# EAGLE schematic RadioMusic_B Rev2 (EAGLE 6.6.0)
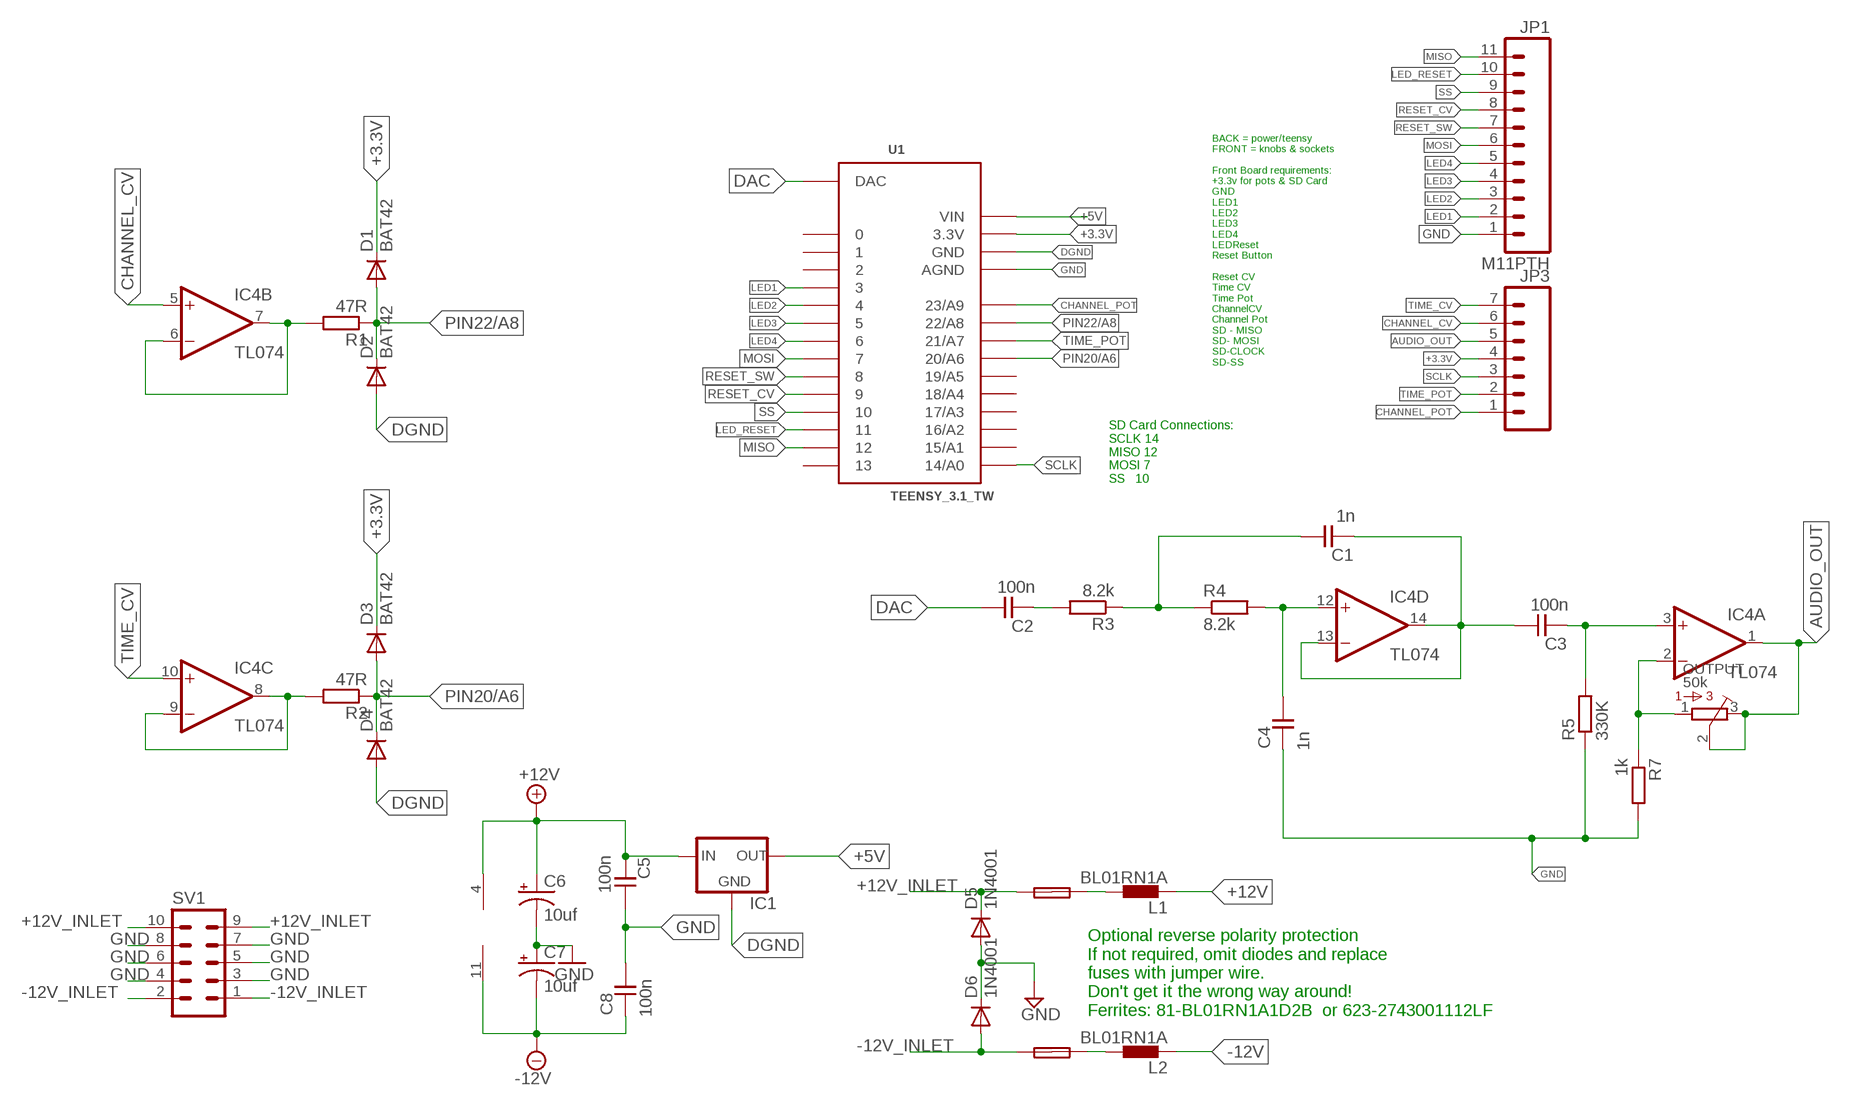
[diagram p0: schematic, sheet 1]

## Parts
C1  1n  C-EU050-024X044  [C050-024X044]
C2  100n  C-EU050-025X075  [C050-025X075]
C3  100n  C-EU050-025X075  [C050-025X075]
C4  1n  C-EU050-024X044  [C050-024X044]
C5  100n  C-EU050-024X044  [C050-024X044]
C6  10uf  CAP_POLPTH2  [CPOL-RADIAL-10UF-25V]
C7  10uf  CAP_POLPTH2  [CPOL-RADIAL-10UF-25V]
C8  100n  C-EU050-024X044  [C050-024X044]
D1  BAT42  BAT81  [DO34-7]
D2  BAT42  BAT81  [DO34-7]
D3  BAT42  BAT81  [DO34-7]
D4  BAT42  BAT81  [DO34-7]
D5  1N4001  1N4004  [DO41-10]
D6  1N4001  1N4004  [DO41-10]
F1  FUSE  PTC_FUSEPOLY_FUSE  [C050H075X075]
F2  FUSE  PTC_FUSEPOLY_FUSE  [C050H075X075]
IC1  78LXX  [78LXX]
IC4  TL074  TL074P  [DIL14]
JP1  M11PTH  [1X11]
JP3  M07  [1X07]
L1  BL01RN1A  [BL01RN1A]
L2  BL01RN1A  [BL01RN1A]
OUTPUT  50k  3362P  [3362P]
R1  47R  R-EU_STANDARD_RESISTOR  [0207/10]
R2  47R  R-EU_STANDARD_RESISTOR  [0207/10]
R3  8.2k  R-EU_STANDARD_RESISTOR  [0207/10]
R4  8.2k  R-EU_STANDARD_RESISTOR  [0207/10]
R5  330K  R-EU_STANDARD_RESISTOR  [0207/10]
R7  1k  R-EU_STANDARD_RESISTOR  [0207/10]
SV1  10_PIN_HEADER  [MA05-2]
U1  TEENSY_3.1_TW  [TEENSY_3.1_TW]

## Nets
+3.3V: D1.C D3.C JP3.4 U1.3.3V
+5V: IC1.OUT U1.VIN
+12V [power]: C5.2 C6.1(+) IC1.IN IC4.4(P:V+) L1.1
+12V_INLET [power]: D5.C F1.1 SV1.9 SV1.10
-12V [power]: C7.2(-) C8.2 IC4.11(P:V-) L2.1
-12V_INLET [power]: D6.A F2.1 SV1.1 SV1.2
AUDIO_OUT: IC4.1(A:OUT) JP3.5 OUTPUT.2 OUTPUT.3
CHANNEL_CV: IC4.5(B:+IN) JP3.6
CHANNEL_POT: JP3.1 U1.23/A9
DAC: C2.1 U1.DAC
DGND: D2.A D4.A IC1.GND U1.GND
GND [ground]: C4.2 C5.1 C6.2(-) C7.1(+) C8.1 D5.A D6.C JP1.1 R5.1 R7.2 SV1.3 SV1.4 SV1.5 SV1.6 SV1.7 SV1.8 U1.AGND
LED1: JP1.2 U1.3
LED2: JP1.3 U1.4
LED3: JP1.4 U1.5
LED4: JP1.5 U1.6
LED_RESET: JP1.10 U1.11
MISO: JP1.11 U1.12
MOSI: JP1.6 U1.7
N$1: IC4.8(C:OUT) IC4.9(C:-IN) R2.2
N$2: C4.1 IC4.12(D:+IN) R4.2
N$3: IC4.6(B:-IN) IC4.7(B:OUT) R1.2
N$4: C1.1 R3.1 R4.1
N$5: C1.2 C3.1 IC4.13(D:-IN) IC4.14(D:OUT)
N$6: C3.2 IC4.3(A:+IN) R5.2
N$7: IC4.2(A:-IN) OUTPUT.1 R7.1
N$10: C2.2 R3.2
N$22 [power]: F1.2 L1.2
N$23 [power]: F2.2 L2.2
PIN20/A6: D3.A D4.C R2.1 U1.20/A6
PIN22/A8: D1.A D2.C R1.1 U1.22/A8
RESET_CV: JP1.8 U1.9
RESET_SW: JP1.7 U1.8
SCLK: JP3.3 U1.14/A0
SS: JP1.9 U1.10
TIME_CV: IC4.10(C:+IN) JP3.7
TIME_POT: JP3.2 U1.21/A7
Unconnected: U1.0 U1.1 U1.2 U1.13 U1.15/A1 U1.16/A2 U1.17/A3 U1.18/A4 U1.19/A5

## Notes on the sheet
- BACK = power/teensy
  FRONT = knobs & sockets
  
  Front Board requirements:
  +3.3v for pots & SD Card 
  GND 
  LED1
  LED2
  LED3
  LED4
  LEDReset
  Reset Button
  
  Reset CV 
  Time CV
  Time Pot
  ChannelCV
  Channel Pot
  SD - MISO
  SD- MOSI
  SD-CLOCK
  SD-SS
- SD Card Connections: 
   SCLK 14
   MISO 12
   MOSI 7 
   SS   10
- Optional reverse polarity protection
  If not required, omit diodes and replace
  fuses with jumper wire. 
  Don't get it the wrong way around! 
  Ferrites: 81-BL01RN1A1D2B  or 623-2743001112LF

## Library data of the parts
C1-C5 C8 = TomW:C-EU: CAPACITOR, European symbol
C6 C7 = SparkFun-Passives:CAP_POL: Capacitor Polarized These are standard SMD and PTH capacitors. Normally 10uF, 47uF, and 100uF in electrolytic and tantalum varieties. Always verify the external diameter of the through hole cap, it varies with capacity, voltage, and manufacturer. The EIA devices should be standard.
D1-D4 = diode:BAT81: DIODE barrier diode
D5 D6 = diode:1N4004: DIODE general purpose rectifier, 1 A
F1 F2 = TomW:PTC_FUSE
IC1 = v-reg:78LXX: VOLTAGE REGULATOR
IC4 = linear:TL074: OP AMP
JP1 = SparkFun-Connectors:M11: Header 11 Standard 11-pin 0.1" header. Use with straight break away headers (SKU : PRT-00116), right angle break away headers (PRT-00553), swiss pins (PRT-00743), machine pins (PRT-00117), and female headers (PRT-00115).
JP3 = SparkFun-Connectors:M07: Header 7 Standard 7-pin 0.1" header. Use with straight break away headers (SKU : PRT-00116), right angle break away headers (PRT-00553), swiss pins (PRT-00743), machine pins (PRT-00117), and female headers (PRT-00115). NOTES ON THE VARIANTS LOCK and LOCK_LONGPADS... This footprint was designed to help hold the alignment of a through-hole component (i.e. 7-pin header) while soldering it into place. You may notice that each hole has been shifted either up or down by 0.005 of an inch from it's more standard position (which is usually a perfectly straight line). This slight alteration caused the pins (the squares in the middle) to touch the edges of the holes. Because they are alternating, it causes a "brace" to hold the header in place. 0.005 has proven to be the perfect amount of "off-center" position when using our standard breakaway headers. Although looks a little odd when you look at the bare footprint, once you have a header in there, the alteration is very hard to notice. Also, if you push a header all the way into place, it is covered up entirely on the bottom side. This idea of altering the position of holes to aid alignment will be further integrated into the Sparkfun Library for other footprints. It can help hold any component with 3 or more connection pins.
L1 L2 = inductors:BL0: Noise Suppression Products/EMI Suppression Filters, Lead EMIFIL(R) Inductor Type Source: http://www.murata.com .. BL01RN1_DS.pdf
OUTPUT = bourns:3362: 3362 Series 1/4" Square Trimmer
R1-R5 R7 = TomW:R-EU_: RESISTOR, European symbol
SV1 = TomW:10_PIN_HEADER: PIN HEADER; OC_FARNELL: unknown; OC_NEWARK: unknown
U1 = TomW:TEENSY_3.1_TW: Basic Teensy 3.0 with none of the 'inner' pins enabled. See '+4', 'AllAnalogPins", and 'AllPins' packages for additional pin holes, as needed.

## Net classes
0 default: width 0.203 mm
1 power: width 0.305 mm
2 ground: width 0.305 mm